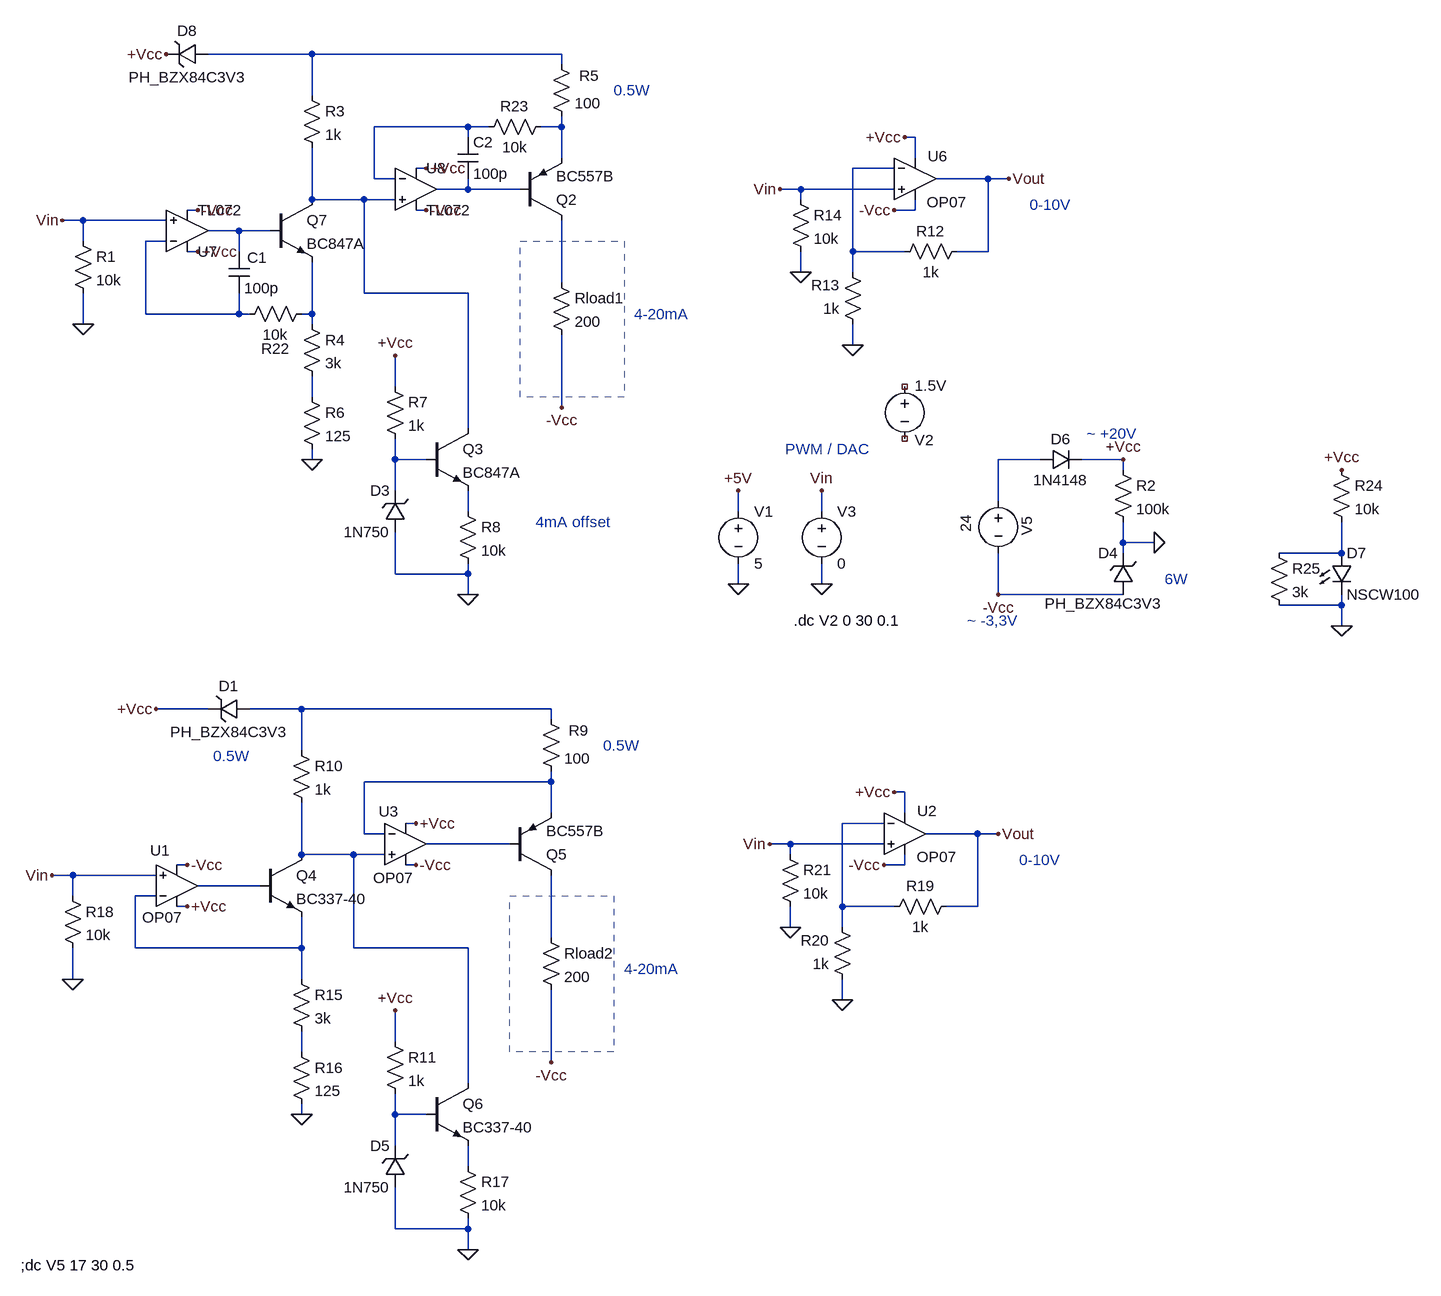
[diagram p0: schematic 420-transmitter.asc]
420-transmitter.asc, the LTspice schematic file:
Version 4
SHEET 1 5048 1864
WIRE 2656 -16 2496 -16
WIRE 3040 -16 2656 -16
WIRE 3040 0 3040 -16
WIRE 2656 48 2656 -16
WIRE 2896 96 2752 96
WIRE 2928 96 2896 96
WIRE 3040 96 3040 80
WIRE 3040 96 3008 96
WIRE 2896 112 2896 96
WIRE 3584 112 3568 112
WIRE 3040 144 3040 96
WIRE 3584 144 3584 112
WIRE 2832 160 2816 160
WIRE 3552 160 3488 160
WIRE 2752 176 2752 96
WIRE 2784 176 2752 176
WIRE 3696 176 3616 176
WIRE 3728 176 3696 176
WIRE 2896 192 2896 176
WIRE 2896 192 2848 192
WIRE 2976 192 2896 192
WIRE 3408 192 3376 192
WIRE 3552 192 3408 192
WIRE 2656 208 2656 128
WIRE 2736 208 2656 208
WIRE 2784 208 2736 208
WIRE 3408 208 3408 192
WIRE 2480 224 2464 224
WIRE 2832 224 2816 224
WIRE 3584 224 3584 208
WIRE 3584 224 3552 224
WIRE 2304 240 2272 240
WIRE 2432 240 2304 240
WIRE 2544 256 2496 256
WIRE 2592 256 2544 256
WIRE 2304 272 2304 240
WIRE 2432 272 2400 272
WIRE 2480 288 2464 288
WIRE 2544 288 2544 256
WIRE 3488 288 3488 160
WIRE 3568 288 3488 288
WIRE 3696 288 3696 176
WIRE 3696 288 3648 288
WIRE 3408 320 3408 288
WIRE 3488 320 3488 288
WIRE 3040 336 3040 240
WIRE 2736 352 2736 208
WIRE 2896 352 2736 352
WIRE 2400 384 2400 272
WIRE 2544 384 2544 352
WIRE 2544 384 2400 384
WIRE 2560 384 2544 384
WIRE 2656 384 2656 304
WIRE 2656 384 2640 384
WIRE 2304 400 2304 352
WIRE 2656 400 2656 384
WIRE 3488 432 3488 400
WIRE 2784 496 2784 448
WIRE 2656 512 2656 480
WIRE 3040 528 3040 416
WIRE 2896 560 2896 352
WIRE 2656 608 2656 592
WIRE 2784 608 2784 576
WIRE 2832 608 2784 608
WIRE 3776 608 3712 608
WIRE 3904 608 3840 608
WIRE 3904 624 3904 608
WIRE 2784 656 2784 608
WIRE 3712 672 3712 608
WIRE 2896 688 2896 656
WIRE 3312 688 3312 656
WIRE 3440 688 3440 656
WIRE 3904 736 3904 704
WIRE 3952 736 3904 736
WIRE 3904 752 3904 736
WIRE 4240 752 4240 704
WIRE 4240 752 4144 752
WIRE 2784 784 2784 720
WIRE 2896 784 2896 768
WIRE 2896 784 2784 784
WIRE 3312 800 3312 768
WIRE 3440 800 3440 768
WIRE 2896 816 2896 784
WIRE 3712 816 3712 752
WIRE 3904 816 3712 816
WIRE 4240 832 4240 816
WIRE 4240 832 4144 832
WIRE 4240 864 4240 832
WIRE 2496 992 2416 992
WIRE 2640 992 2560 992
WIRE 3024 992 2640 992
WIRE 3024 1008 3024 992
WIRE 2640 1056 2640 992
WIRE 3024 1104 3024 1088
WIRE 3024 1104 2736 1104
WIRE 3568 1120 3552 1120
WIRE 3024 1152 3024 1104
WIRE 3568 1152 3568 1120
WIRE 2816 1168 2800 1168
WIRE 3536 1168 3472 1168
WIRE 2736 1184 2736 1104
WIRE 2768 1184 2736 1184
WIRE 3680 1184 3600 1184
WIRE 3712 1184 3680 1184
WIRE 2960 1200 2832 1200
WIRE 3392 1200 3360 1200
WIRE 3536 1200 3392 1200
WIRE 2640 1216 2640 1136
WIRE 2720 1216 2640 1216
WIRE 2768 1216 2720 1216
WIRE 3392 1216 3392 1200
WIRE 2464 1232 2448 1232
WIRE 2816 1232 2800 1232
WIRE 3568 1232 3568 1216
WIRE 3568 1232 3536 1232
WIRE 2288 1248 2256 1248
WIRE 2416 1248 2288 1248
WIRE 2576 1264 2480 1264
WIRE 2288 1280 2288 1248
WIRE 2416 1280 2384 1280
WIRE 2464 1296 2448 1296
WIRE 3472 1296 3472 1168
WIRE 3552 1296 3472 1296
WIRE 3680 1296 3680 1184
WIRE 3680 1296 3632 1296
WIRE 3392 1328 3392 1296
WIRE 3472 1328 3472 1296
WIRE 3024 1344 3024 1248
WIRE 2384 1360 2384 1280
WIRE 2640 1360 2640 1312
WIRE 2640 1360 2384 1360
WIRE 2720 1360 2720 1216
WIRE 2896 1360 2720 1360
WIRE 2288 1408 2288 1360
WIRE 2640 1408 2640 1360
WIRE 3472 1440 3472 1408
WIRE 2784 1504 2784 1456
WIRE 2640 1520 2640 1488
WIRE 3024 1536 3024 1424
WIRE 2896 1568 2896 1360
WIRE 2640 1616 2640 1600
WIRE 2784 1616 2784 1584
WIRE 2832 1616 2784 1616
WIRE 2784 1664 2784 1616
WIRE 2896 1696 2896 1664
WIRE 2784 1792 2784 1728
WIRE 2896 1792 2896 1776
WIRE 2896 1792 2784 1792
WIRE 2896 1824 2896 1792
FLAG 3904 608 +Vcc
FLAG 3440 800 0
FLAG 3440 656 Vin
FLAG 3488 432 0
FLAG 3376 192 Vin
FLAG 3568 112 +Vcc
FLAG 3552 224 -Vcc
FLAG 3728 176 Vout
FLAG 2432 -16 +Vcc
FLAG 2272 240 Vin
FLAG 2832 224 -Vcc
FLAG 2480 224 -Vcc
FLAG 2480 288 +Vcc
FLAG 2832 160 +Vcc
FLAG 3712 816 -Vcc
FLAG 3040 528 -Vcc
FLAG 2656 608 0
FLAG 2304 400 0
FLAG 3408 320 0
FLAG 2896 816 0
FLAG 3472 1440 0
FLAG 3360 1200 Vin
FLAG 3552 1120 +Vcc
FLAG 3536 1232 -Vcc
FLAG 3712 1184 Vout
FLAG 2416 992 +Vcc
FLAG 2256 1248 Vin
FLAG 2816 1232 -Vcc
FLAG 2464 1232 -Vcc
FLAG 2464 1296 +Vcc
FLAG 2816 1168 +Vcc
FLAG 3024 1536 -Vcc
FLAG 2640 1616 0
FLAG 2288 1408 0
FLAG 3392 1328 0
FLAG 2896 1824 0
FLAG 3952 736 0
FLAG 3312 800 0
FLAG 3312 656 +5V
FLAG 4240 624 +Vcc
FLAG 4240 864 0
FLAG 2784 448 +Vcc
FLAG 2784 1456 +Vcc
SYMBOL voltage 3568 480 R0
WINDOW 123 0 0 Left 0
WINDOW 39 0 0 Left 0
WINDOW 0 15 98 Left 2
WINDOW 3 15 14 Left 2
SYMATTR InstName V2
SYMATTR Value 1.5V
SYMBOL pnp 2976 240 M180
SYMATTR InstName Q2
SYMATTR Value BC557B
SYMBOL res 3024 -16 R0
WINDOW 0 43 33 Left 2
SYMATTR InstName R5
SYMATTR Value 100
SYMBOL res 2640 32 R0
SYMATTR InstName R3
SYMATTR Value 1k
SYMBOL res 3024 320 R0
SYMATTR InstName Rload1
SYMATTR Value 200
SYMBOL Opamps\\OP07 3584 112 R0
WINDOW 0 19 29 Left 2
WINDOW 3 18 100 Left 2
SYMATTR InstName U6
SYMBOL voltage 3712 656 R0
WINDOW 123 0 0 Left 0
WINDOW 39 0 0 Left 0
WINDOW 0 44 40 VRight 2
WINDOW 3 -50 37 VRight 2
SYMATTR InstName V5
SYMATTR Value 24
SYMBOL zener 3920 816 R180
WINDOW 0 24 64 Left 2
WINDOW 3 -43 -14 Left 2
SYMATTR InstName D4
SYMATTR Value PH_BZX84C3V3
SYMBOL res 3888 608 R0
SYMATTR InstName R2
SYMATTR Value 100k
SYMBOL npn 2832 560 R0
SYMATTR InstName Q3
SYMATTR Value BC847A
SYMBOL zener 2800 720 R180
WINDOW 0 24 64 Left 2
WINDOW 3 24 0 Left 2
SYMATTR InstName D3
SYMATTR Value 1N750
SYMATTR Description Schottky diode
SYMATTR Type schottky
SYMBOL res 2768 480 R0
SYMATTR InstName R7
SYMATTR Value 1k
SYMBOL res 2640 384 R0
SYMATTR InstName R4
SYMATTR Value 3k
SYMBOL res 2640 496 R0
SYMATTR InstName R6
SYMATTR Value 125
SYMBOL res 2880 672 R0
SYMATTR InstName R8
SYMATTR Value 10k
SYMBOL res 2288 256 R0
SYMATTR InstName R1
SYMATTR Value 10k
SYMBOL res 3664 272 R90
WINDOW 0 0 56 VBottom 2
WINDOW 3 32 56 VTop 2
SYMATTR InstName R12
SYMATTR Value 1k
SYMBOL res 3504 416 R180
WINDOW 0 36 76 Left 2
WINDOW 3 36 40 Left 2
SYMATTR InstName R13
SYMATTR Value 1k
SYMBOL res 3392 192 R0
SYMATTR InstName R14
SYMATTR Value 10k
SYMBOL npn 2576 1216 R0
SYMATTR InstName Q4
SYMATTR Value BC337-40
SYMBOL pnp 2960 1248 M180
SYMATTR InstName Q5
SYMATTR Value BC557B
SYMBOL res 3008 992 R0
WINDOW 0 43 33 Left 2
SYMATTR InstName R9
SYMATTR Value 100
SYMBOL res 2624 1040 R0
SYMATTR InstName R10
SYMATTR Value 1k
SYMBOL res 3008 1328 R0
SYMATTR InstName Rload2
SYMATTR Value 200
SYMBOL Opamps\\OP07 2448 1328 M180
WINDOW 0 -41 118 Left 2
WINDOW 3 -53 15 Left 2
SYMATTR InstName U1
SYMBOL Opamps\\OP07 3568 1120 R0
WINDOW 0 19 29 Left 2
WINDOW 3 18 100 Left 2
SYMATTR InstName U2
SYMBOL Opamps\\OP07 2800 1136 R0
WINDOW 0 -41 14 Left 2
WINDOW 3 -50 116 Left 2
SYMATTR InstName U3
SYMBOL npn 2832 1568 R0
SYMATTR InstName Q6
SYMATTR Value BC337-40
SYMBOL zener 2800 1728 R180
WINDOW 0 24 64 Left 2
WINDOW 3 24 0 Left 2
SYMATTR InstName D5
SYMATTR Value 1N750
SYMATTR Description Schottky diode
SYMATTR Type schottky
SYMBOL res 2768 1488 R0
SYMATTR InstName R11
SYMATTR Value 1k
SYMBOL res 2624 1392 R0
SYMATTR InstName R15
SYMATTR Value 3k
SYMBOL res 2624 1504 R0
SYMATTR InstName R16
SYMATTR Value 125
SYMBOL res 2880 1680 R0
SYMATTR InstName R17
SYMATTR Value 10k
SYMBOL res 2272 1264 R0
SYMATTR InstName R18
SYMATTR Value 10k
SYMBOL res 3648 1280 R90
WINDOW 0 0 56 VBottom 2
WINDOW 3 32 56 VTop 2
SYMATTR InstName R19
SYMATTR Value 1k
SYMBOL res 3488 1424 R180
WINDOW 0 36 76 Left 2
WINDOW 3 36 40 Left 2
SYMATTR InstName R20
SYMATTR Value 1k
SYMBOL res 3376 1200 R0
SYMATTR InstName R21
SYMATTR Value 10k
SYMBOL voltage 3312 672 R0
WINDOW 123 0 0 Left 0
WINDOW 39 0 0 Left 0
SYMATTR InstName V1
SYMATTR Value 5
SYMBOL diode 3776 624 R270
WINDOW 0 32 32 VTop 2
WINDOW 3 0 32 VBottom 2
SYMATTR InstName D6
SYMATTR Value 1N4148
SYMBOL cap 2528 288 R0
WINDOW 0 28 9 Left 2
SYMATTR InstName C1
SYMATTR Value 100p
SYMBOL res 2656 368 R90
WINDOW 0 85 56 VBottom 2
WINDOW 3 32 56 VTop 2
SYMATTR InstName R22
SYMATTR Value 10k
SYMBOL cap 2880 112 R0
SYMATTR InstName C2
SYMATTR Value 100p
SYMBOL res 3024 80 R90
WINDOW 0 0 56 VBottom 2
WINDOW 3 32 56 VTop 2
SYMATTR InstName R23
SYMATTR Value 10k
SYMBOL res 4224 608 R0
SYMATTR InstName R24
SYMATTR Value 10k
SYMBOL res 4128 736 R0
SYMATTR InstName R25
SYMATTR Value 3k
SYMBOL LED 4224 752 R0
SYMATTR InstName D7
SYMATTR Value NSCW100
SYMATTR Description Diode
SYMATTR Type diode
SYMBOL zener 2496 -32 R90
WINDOW 0 -4 32 VBottom 2
WINDOW 3 36 32 VTop 2
SYMATTR InstName D8
SYMATTR Value PH_BZX84C3V3
SYMBOL zener 2560 976 R90
WINDOW 0 -4 32 VBottom 2
WINDOW 3 36 32 VTop 2
SYMATTR InstName D1
SYMATTR Value PH_BZX84C3V3
SYMBOL voltage 3440 672 R0
WINDOW 123 0 0 Left 0
WINDOW 39 0 0 Left 0
SYMATTR InstName V3
SYMATTR Value 0
SYMBOL Opamps\\TL072 2816 128 R0
SYMATTR InstName U8
SYMBOL Opamps\\TL072 2464 320 M180
SYMATTR InstName U7
SYMBOL npn 2592 208 R0
SYMATTR InstName Q7
SYMATTR Value BC847A
TEXT 3560 856 Right 2 !.dc V2 0 30 0.1
TEXT 3152 384 Left 2 ;4-20mA
TEXT 3760 216 Left 2 ;0-10V
TEXT 3000 704 Left 2 ;4mA offset
TEXT 3848 568 Left 2 ;~ +20V
TEXT 3664 856 Left 2 ;~ -3,3V
TEXT 3384 592 Left 2 ;PWM / DAC
TEXT 3120 40 Left 2 ;0.5W
TEXT 3968 792 Left 2 ;6W
TEXT 3136 1392 Left 2 ;4-20mA
TEXT 3744 1224 Left 2 ;0-10V
TEXT 3104 1048 Left 2 ;0.5W
TEXT 2504 1064 Left 2 ;0.5W
TEXT 2208 1848 Left 2 !;dc V5 17 30 0.5
RECTANGLE Normal 3136 512 2976 272 2
RECTANGLE Normal 3120 1520 2960 1280 2

The netlist it stands for:
* 420-transmitter.asc
V2 NC_01 NC_02 1.5V
Q2 N009 N005 N003 0 BC557B
R5 N001 N003 100
R3 N001 N006 1k
Rload1 N009 -Vcc 200
XU6 Vin N004 +Vcc -Vcc Vout LT1001  ; OP07, pins In+ In- V+ V- OUT
V5 N013 -Vcc 24
D4 -Vcc 0 PH_BZX84C3V3
R2 +Vcc 0 100k
Q3 N006 N012 N014 0 BC847A
D3 0 N012 1N750
R7 +Vcc N012 1k
R4 N010 N011 3k
R6 N011 0 125
R8 N014 0 10k
R1 Vin 0 10k
R12 Vout N004 1k
R13 0 N004 1k
R14 Vin 0 10k
Q4 N020 N021 N022 0 BC337-40
Q5 N023 N019 N017 0 BC557B
R9 N016 N017 100
R10 N016 N020 1k
Rload2 N023 -Vcc 200
XU1 Vin N022 +Vcc -Vcc N021 LT1001  ; OP07, pins In+ In- V+ V- OUT
XU2 Vin N018 +Vcc -Vcc Vout LT1001  ; OP07, pins In+ In- V+ V- OUT
XU3 N020 N017 +Vcc -Vcc N019 LT1001  ; OP07, pins In+ In- V+ V- OUT
Q6 N020 N025 N026 0 BC337-40
D5 0 N025 1N750
R11 +Vcc N025 1k
R15 N022 N024 3k
R16 N024 0 125
R17 N026 0 10k
R18 Vin 0 10k
R19 Vout N018 1k
R20 0 N018 1k
R21 Vin 0 10k
V1 +5V 0 5
D6 N013 +Vcc 1N4148
C1 N007 N008 100p
R22 N010 N008 10k
C2 N002 N005 100p
R23 N003 N002 10k
R24 +Vcc N015 10k
R25 N015 0 3k
D7 N015 0 NSCW100
D8 N001 +Vcc PH_BZX84C3V3
D1 N016 +Vcc PH_BZX84C3V3
V3 Vin 0 0
XU8 N006 N002 +Vcc -Vcc N005 TL072  ; pins In+ In- V+ V- OUT
XU7 Vin N008 +Vcc -Vcc N007 TL072  ; pins In+ In- V+ V- OUT
Q7 N006 N007 N010 0 BC847A
.model D D
.lib standard.dio
.model NPN NPN
.model PNP PNP
.lib standard.bjt
.dc V2 0 30 0.1
* 4-20mA
* 0-10V
* 4mA offset
* ~ +20V
* ~ -3,3V
* PWM / DAC
* 0.5W
* 6W
* 4-20mA
* 0-10V
* 0.5W
* 0.5W
;dc V5 17 30 0.5
.lib LTC.lib
.backanno
.end